# EAGLE schematic GPS lure (EAGLE 7.6.0)
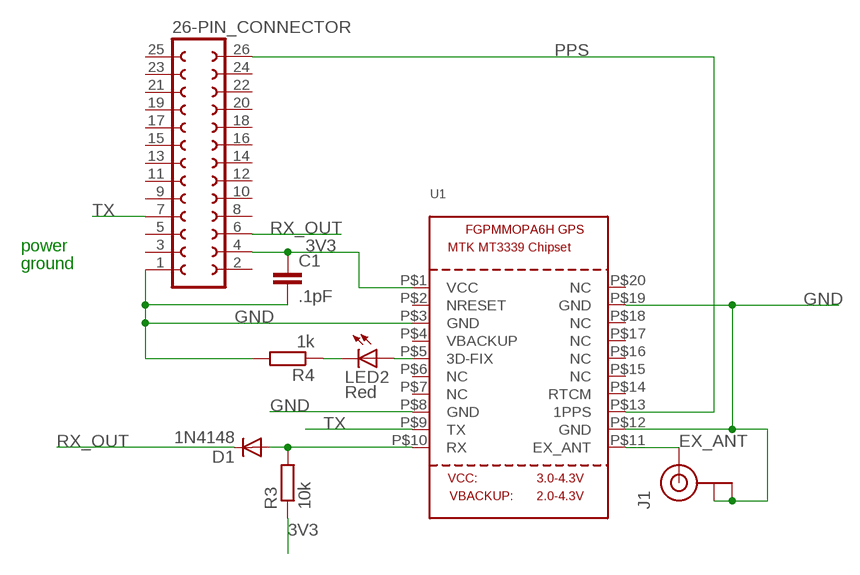
[diagram p0: schematic, sheet 1]

## Parts
26-PIN_CONNECTOR  FE13-2W  [FE13-2W]
C1  .1pF  C-EUC0805  [C0805]
D1  1N4148  DIODE-SOD123  [SOD123]
J1  U.FL  [U.FL]
LED2  Red  LEDCHIPLED_1206  [CHIPLED_1206]
R3  10k  R-EU_M1206  [M1206]
R4  1k  R-EU_M1206  [M1206]
U1  GPS_FGPMMOPA6H  [FGPMMOPA6H]

## Nets
3V3: 26-PIN_CONNECTOR.4 C1.1 R3.1 U1.P$1(VCC)
EX_ANT: J1.P$3(SIGNAL) U1.P$11(EX_ANT)
GND: 26-PIN_CONNECTOR.1 C1.2 J1.P$1(GND) J1.P$2(GND) R4.2 U1.P$3(GND) U1.P$8(GND) U1.P$12(GND) U1.P$19(GND)
N$1: LED2.A U1.P$5(3D-FIX)
N$2: LED2.C R4.1
N$4: D1.A R3.2 U1.P$10(RX)
PPS: 26-PIN_CONNECTOR.26 U1.P$13(1PPS)
RX_OUT: 26-PIN_CONNECTOR.6 D1.C
TX: 26-PIN_CONNECTOR.7 U1.P$9(TX)
Unconnected: 26-PIN_CONNECTOR.2 26-PIN_CONNECTOR.3 26-PIN_CONNECTOR.5 26-PIN_CONNECTOR.8 26-PIN_CONNECTOR.9 26-PIN_CONNECTOR.10 26-PIN_CONNECTOR.11 26-PIN_CONNECTOR.12 26-PIN_CONNECTOR.13 26-PIN_CONNECTOR.14 26-PIN_CONNECTOR.15 26-PIN_CONNECTOR.16 26-PIN_CONNECTOR.17 26-PIN_CONNECTOR.18 26-PIN_CONNECTOR.19 26-PIN_CONNECTOR.20 26-PIN_CONNECTOR.21 26-PIN_CONNECTOR.22 26-PIN_CONNECTOR.23 26-PIN_CONNECTOR.24 26-PIN_CONNECTOR.25 U1.P$2(NRESET) U1.P$4(VBACKUP) U1.P$6(NC) U1.P$7(NC) U1.P$14(RTCM) U1.P$15(NC) U1.P$16(NC) U1.P$17(NC) U1.P$18(NC) U1.P$20(NC)

## Notes on the sheet
- power
- ground

## Library data of the parts
26-PIN_CONNECTOR = con-lsta:FE13-2W: FEMALE HEADER; OC_FARNELL: unknown; OC_NEWARK: unknown
C1 = rcl:C-EU: CAPACITOR, European symbol
D1 = diode:DIODE-: DIODE
J1 = SparkFun-Connectors:U.FL: SMD antenna connector- WRL-09144; PROD_ID: CONN-09193
LED2 = led:LED: LED OSRAM: - CHIPLED LG R971, LG N971, LY N971, LG Q971, LY Q971, LO R971, LY R971 LH N974, LH R974 LS Q976, LO Q976, LY Q976 LO Q996 - Hyper CHIPLED LW Q18S LB Q993, LB Q99A, LB R99A - SideLED LS A670, LO A670, LY A670, LG A670, LP A670 LB A673, LV A673, LT A673, LW A673 LH A674 LY A675 LS A676, LA A676, LO A676, LY A676, LW A676 LS A679, LY A679, LG A679 - Hyper Micro SIDELED® LS Y876, LA Y876, LO Y876, LY Y876 LT Y87S - SmartLED LW L88C, LW L88S LB L89C, LB L89S, LG L890 LS L89K, LO L89K, LY L89K LS L896, LA L896, LO L896, LY L896 - TOPLED LS T670, LO T670, LY T670, LG T670, LP T670 LSG T670, LSP T670, LSY T670, LOP T670, LYG T670 LG T671, LOG T671, LSG T671 LB T673, LV T673, LT T673, LW T673 LH T674 LS T676, LA T676, LO T676, LY T676, LB T676, LH T676, LSB T676, LW T676 LB T67C, LV T67C, LT T67C, LS T67K, LO T67K, LY T67K, LW E67C LS E67B, LA E67B, LO E67B, LY E67B, LB E67C, LV E67C, LT E67C LW T67C LS T679, LY T679, LG T679 LS T770, LO T770, LY T770, LG T770, LP T770 LB T773, LV T773, LT T773, LW T773 LH T774 LS E675, LA E675, LY E675, LS T675 LS T776, LA T776, LO T776, LY T776, LB T776 LHGB T686 LT T68C, LB T68C - Hyper Mini TOPLED® LB M676 - Mini TOPLED Santana® LG M470 LS M47K, LO M47K, LY M47K Source: http://www.osram.convergy.de LUXEON: - LUMILED® LXK2-PW12-R00, LXK2-PW12-S00, LXK2-PW14-U00, LXK2-PW14-V00 LXK2-PM12-R00, LXK2-PM12-S00, LXK2-PM14-U00 LXK2-PE12-Q00, LXK2-PE12-R00, LXK2-PE12-S00, LXK2-PE14-T00, LXK2-PE14-U00 LXK2-PB12-K00, LXK2-PB12-L00, LXK2-PB12-M00, LXK2-PB14-N00, LXK2-PB14-P00, LXK2-PB14-Q00 LXK2-PR12-L00, LXK2-PR12-M00, LXK2-PR14-Q00, LXK2-PR14-R00 LXK2-PD12-Q00, LXK2-PD12-R00, LXK2-PD12-S00 LXK2-PH12-R00, LXK2-PH12-S00 LXK2-PL12-P00, LXK2-PL12-Q00, LXK2-PL12-R00 Source: www.luxeon.com KINGBRIGHT: KA-3528ASYC Source: www.kingbright.com
R3 R4 = rcl:R-EU_: RESISTOR, European symbol
U1 = adafruit:GPS_FGPMMOPA6H: GPS Module - MTK MT3339 Chipset, -165dBm sensitivity, 22 channels, 10Hz, auto-select external antenna options